# EAGLE design Grove - RGB LED Ring (20-WS2813 Mini) (EAGLE 6.4)
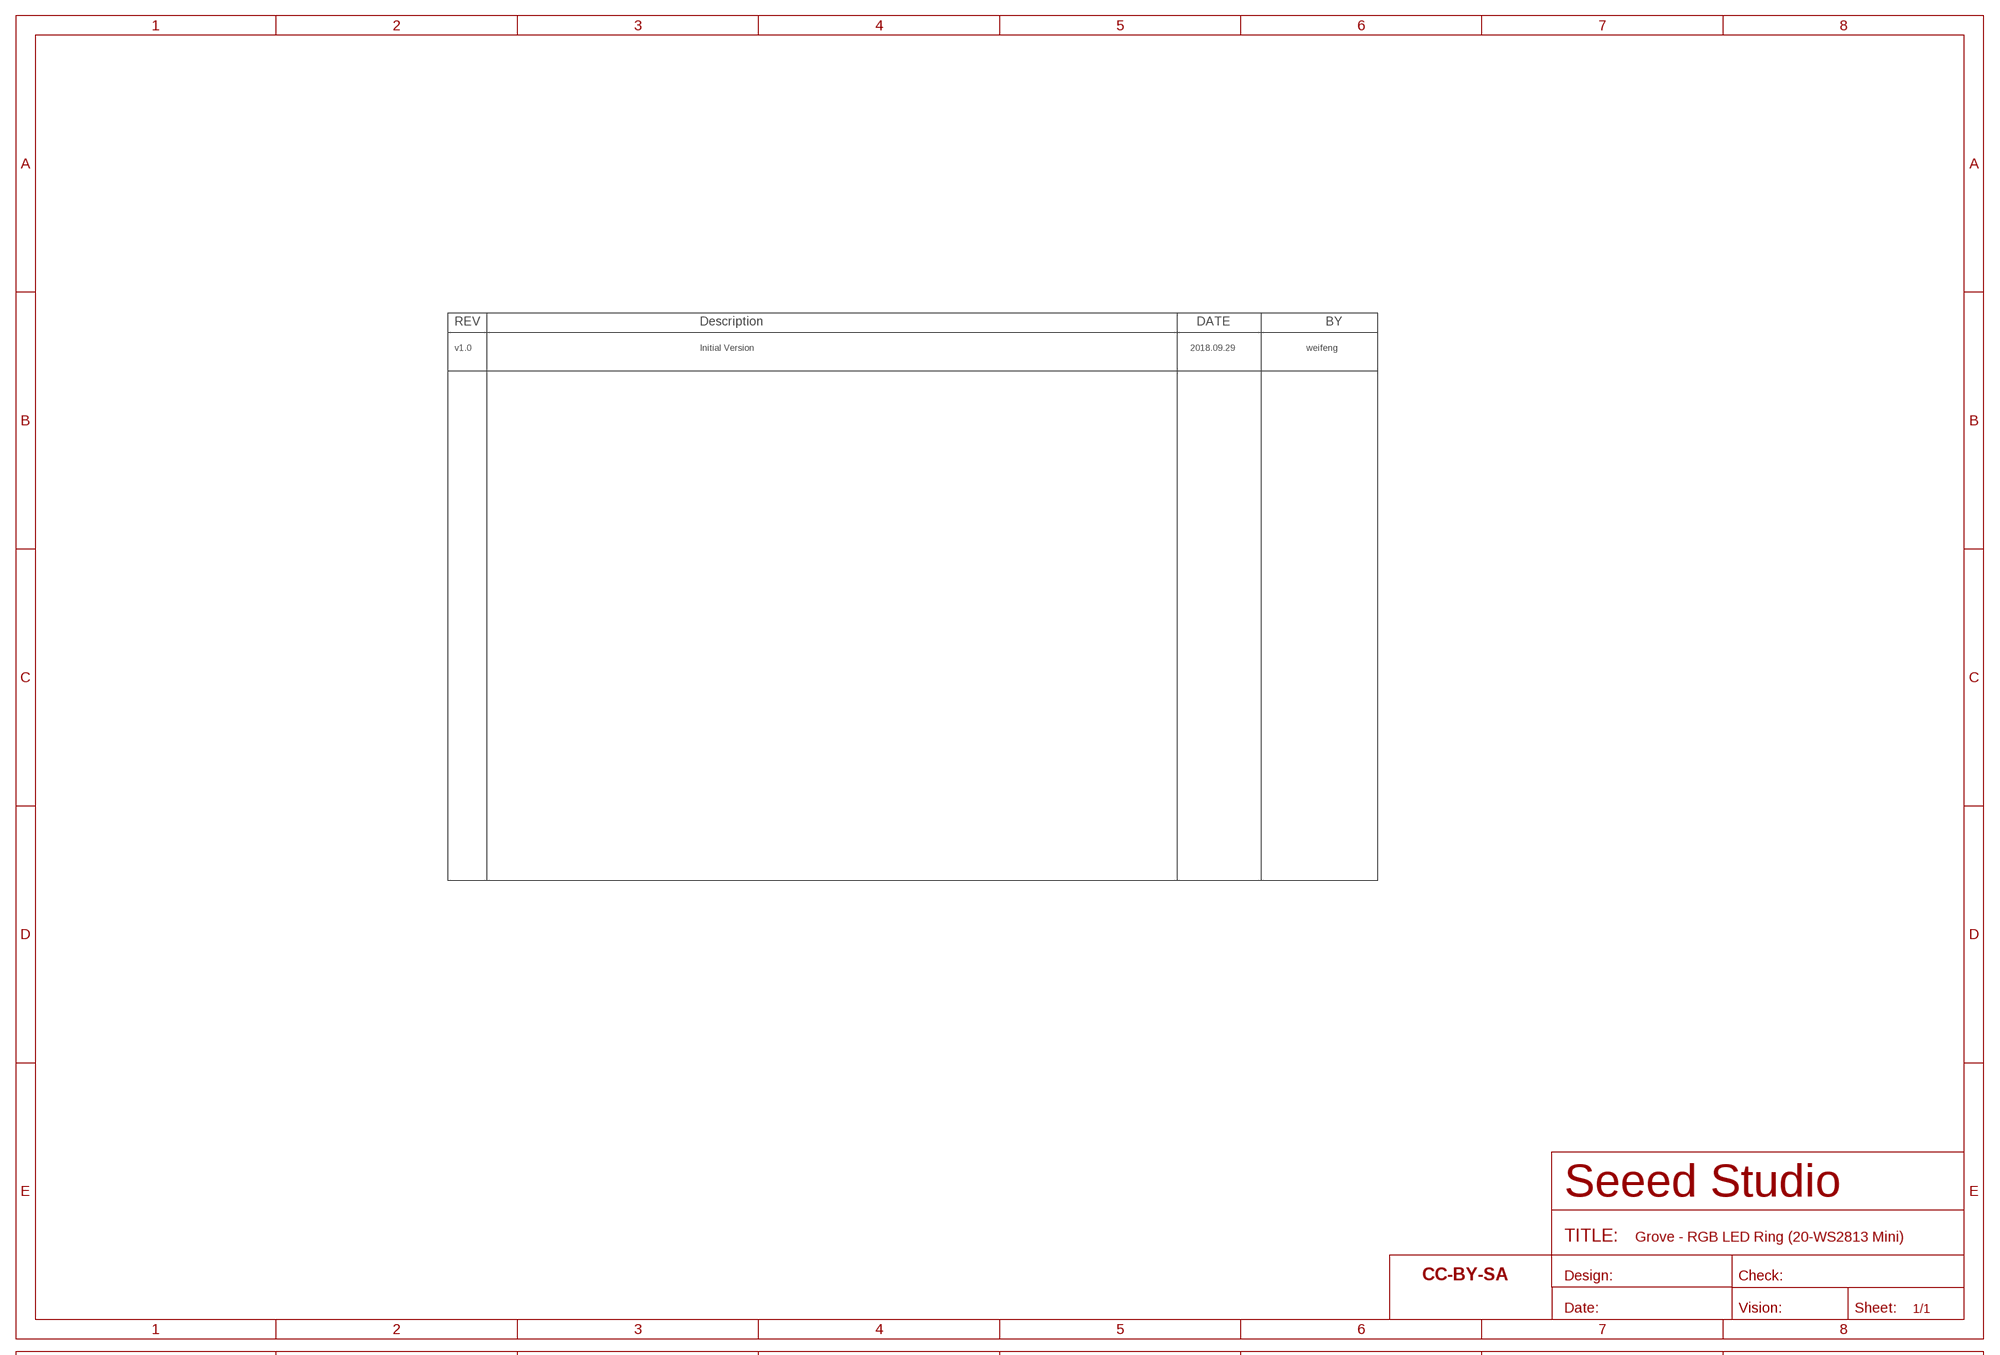
[diagram p0: schematic, sheet 1, part 1 of 2]
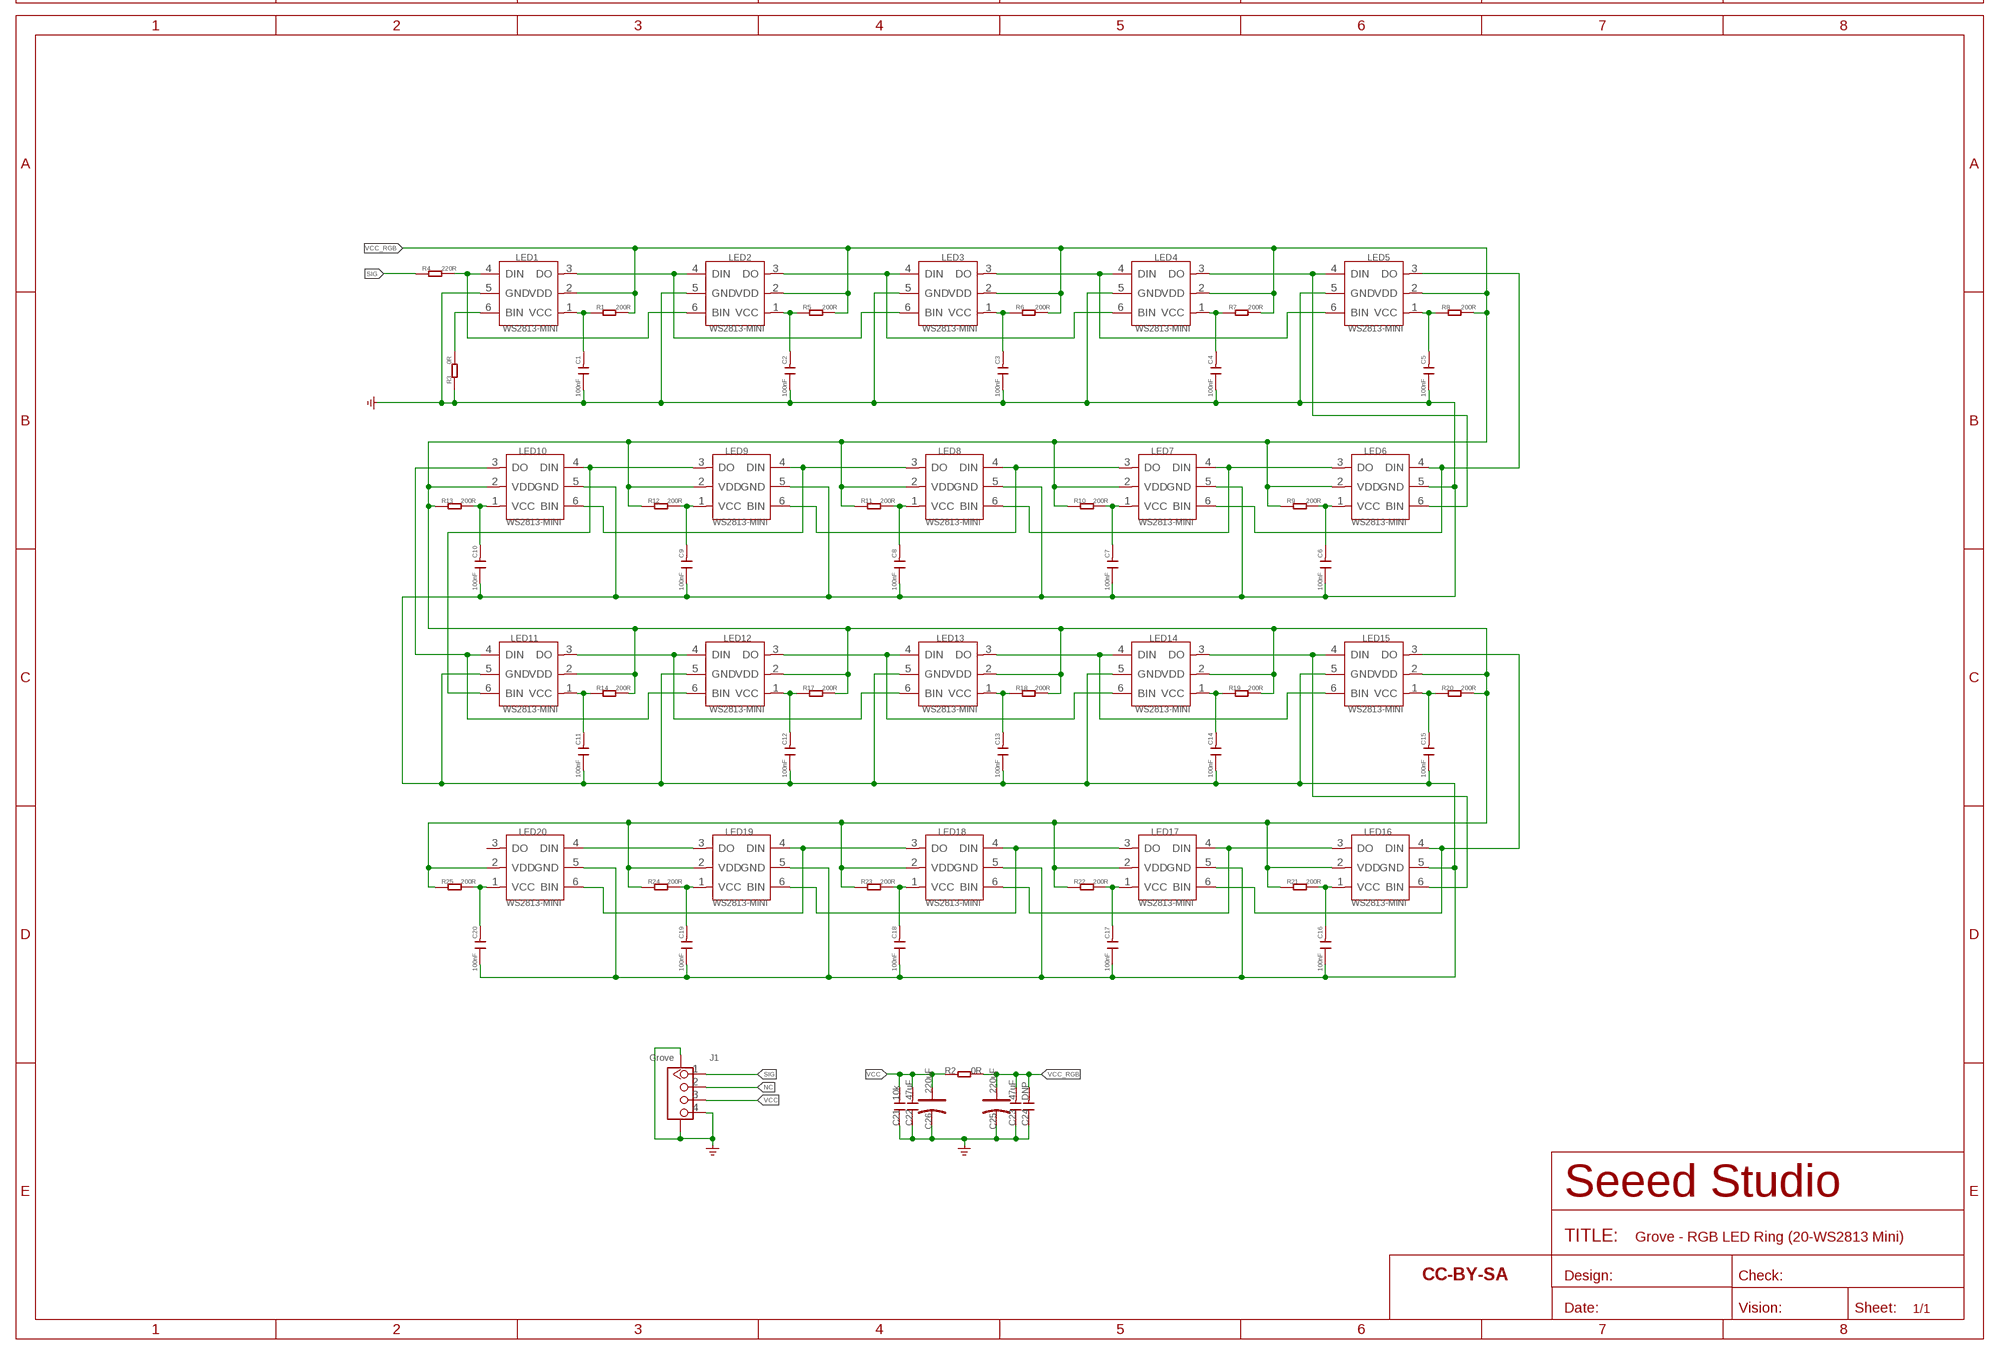
[diagram p1: schematic, sheet 1, part 2 of 2]

## Parts
C1  100nF  C-0603  [C0603]
C2  100nF  C-0603  [C0603]
C3  100nF  C-0603  [C0603]
C4  100nF  C-0603  [C0603]
C5  100nF  C-0603  [C0603]
C6  100nF  C-0603  [C0603]
C7  100nF  C-0603  [C0603]
C8  100nF  C-0603  [C0603]
C9  100nF  C-0603  [C0603]
C10  100nF  C-0603  [C0603]
C11  100nF  C-0603  [C0603]
C12  100nF  C-0603  [C0603]
C13  100nF  C-0603  [C0603]
C14  100nF  C-0603  [C0603]
C15  100nF  C-0603  [C0603]
C16  100nF  C-0603  [C0603]
C17  100nF  C-0603  [C0603]
C18  100nF  C-0603  [C0603]
C19  100nF  C-0603  [C0603]
C20  100nF  C-0603  [C0603]
C21  10k  CAP-0603  [C0603@1]
C22  47uF  CAP-0805  [C0805]
C23  47uF  CAP-0805  [C0805]
C24  DNP  CAP-0603  [C0603@1]
C25  220uF  CAP-POLAR-AVX-B  [AVX-B]
C26  220uF  CAP-POLAR-AVX-B  [AVX-B]
FR1  SEEEDSTUDIO-OPEN-SCH-FRAME-BIG  [SEEEDSTUDIO-PCB-FRAME]
FR2  SEEEDSTUDIO-OPEN-SCH-FRAME-BIG  [SEEEDSTUDIO-PCB-FRAME]
J1  Grove  GROVE-CONNECTOR-SMD'DD'  [HW4-SMD-2.0]
LED1  WS2813-MINI  LED-RGB-6P-WS2813  [LED6-1.1-3.5X3.5X0.95MM]
LED2  WS2813-MINI  LED-RGB-6P-WS2813  [LED6-1.1-3.5X3.5X0.95MM]
LED3  WS2813-MINI  LED-RGB-6P-WS2813  [LED6-1.1-3.5X3.5X0.95MM]
LED4  WS2813-MINI  LED-RGB-6P-WS2813  [LED6-1.1-3.5X3.5X0.95MM]
LED5  WS2813-MINI  LED-RGB-6P-WS2813  [LED6-1.1-3.5X3.5X0.95MM]
LED6  WS2813-MINI  LED-RGB-6P-WS2813  [LED6-1.1-3.5X3.5X0.95MM]
LED7  WS2813-MINI  LED-RGB-6P-WS2813  [LED6-1.1-3.5X3.5X0.95MM]
LED8  WS2813-MINI  LED-RGB-6P-WS2813  [LED6-1.1-3.5X3.5X0.95MM]
LED9  WS2813-MINI  LED-RGB-6P-WS2813  [LED6-1.1-3.5X3.5X0.95MM]
LED10  WS2813-MINI  LED-RGB-6P-WS2813  [LED6-1.1-3.5X3.5X0.95MM]
LED11  WS2813-MINI  LED-RGB-6P-WS2813  [LED6-1.1-3.5X3.5X0.95MM]
LED12  WS2813-MINI  LED-RGB-6P-WS2813  [LED6-1.1-3.5X3.5X0.95MM]
LED13  WS2813-MINI  LED-RGB-6P-WS2813  [LED6-1.1-3.5X3.5X0.95MM]
LED14  WS2813-MINI  LED-RGB-6P-WS2813  [LED6-1.1-3.5X3.5X0.95MM]
LED15  WS2813-MINI  LED-RGB-6P-WS2813  [LED6-1.1-3.5X3.5X0.95MM]
LED16  WS2813-MINI  LED-RGB-6P-WS2813  [LED6-1.1-3.5X3.5X0.95MM]
LED17  WS2813-MINI  LED-RGB-6P-WS2813  [LED6-1.1-3.5X3.5X0.95MM]
LED18  WS2813-MINI  LED-RGB-6P-WS2813  [LED6-1.1-3.5X3.5X0.95MM]
LED19  WS2813-MINI  LED-RGB-6P-WS2813  [LED6-1.1-3.5X3.5X0.95MM]
LED20  WS2813-MINI  LED-RGB-6P-WS2813  [LED6-1.1-3.5X3.5X0.95MM]
R1  200R  R-0603  [R0603]
R2  0R  RES-0805  [R0805]
R3  0R  R-0603  [R0603]
R4  220R  R-0603  [R0603]
R5  200R  R-0603  [R0603]
R6  200R  R-0603  [R0603]
R7  200R  R-0603  [R0603]
R8  200R  R-0603  [R0603]
R9  200R  R-0603  [R0603]
R10  200R  R-0603  [R0603]
R11  200R  R-0603  [R0603]
R12  200R  R-0603  [R0603]
R13  200R  R-0603  [R0603]
R14  200R  R-0603  [R0603]
R17  200R  R-0603  [R0603]
R18  200R  R-0603  [R0603]
R19  200R  R-0603  [R0603]
R20  200R  R-0603  [R0603]
R21  200R  R-0603  [R0603]
R22  200R  R-0603  [R0603]
R23  200R  R-0603  [R0603]
R24  200R  R-0603  [R0603]
R25  200R  R-0603  [R0603]

## Nets
GND: C1.1 C2.1 C3.1 C4.1 C5.1 C6.1 C7.1 C8.1 C9.1 C10.1 C11.1 C12.1 C13.1 C14.1 C15.1 C16.1 C17.1 C18.1 C19.1 C20.1 C21.1 C22.1 C23.1 C24.1 C25.- C26.- J1.4 J1.SS1 J1.SS2 LED1.5(GND) LED2.5(GND) LED3.5(GND) LED4.5(GND) LED5.5(GND) LED6.5(GND) LED7.5(GND) LED8.5(GND) LED9.5(GND) LED10.5(GND) LED11.5(GND) LED12.5(GND) LED13.5(GND) LED14.5(GND) LED15.5(GND) LED16.5(GND) LED17.5(GND) LED18.5(GND) LED19.5(GND) LED20.5(GND) R3.1 ; supply symbol labelled GND_POWER
N$1: C1.2 LED1.1(VCC) R1.1
N$2: LED2.3(DO) LED3.4(DIN) LED4.6(BIN)
N$3: C4.2 LED4.1(VCC) R7.1
N$4: LED1.6(BIN) R3.2
N$5: LED3.3(DO) LED4.4(DIN) LED5.6(BIN)
N$6: LED1.4(DIN) LED2.6(BIN) R4.2
N$7: LED4.3(DO) LED5.4(DIN) LED6.6(BIN)
N$8: C5.2 LED5.1(VCC) R8.1
N$9: LED5.3(DO) LED6.4(DIN) LED7.6(BIN)
N$10: C2.2 LED2.1(VCC) R5.1
N$12: C6.2 LED6.1(VCC) R9.2
N$14: LED1.3(DO) LED2.4(DIN) LED3.6(BIN)
N$16: C3.2 LED3.1(VCC) R6.1
N$18: LED6.3(DO) LED7.4(DIN) LED8.6(BIN)
N$21: C7.2 LED7.1(VCC) R10.2
N$23: LED7.3(DO) LED8.4(DIN) LED9.6(BIN)
N$26: C8.2 LED8.1(VCC) R11.2
N$29: LED8.3(DO) LED9.4(DIN) LED10.6(BIN)
N$32: C9.2 LED9.1(VCC) R12.2
N$35: LED9.3(DO) LED10.4(DIN) LED11.6(BIN)
N$38: C10.2 LED10.1(VCC) R13.2
N$41: C11.2 LED11.1(VCC) R14.1
N$43: LED10.3(DO) LED11.4(DIN) LED12.6(BIN)
N$44: C12.2 LED12.1(VCC) R17.1
N$45: LED11.3(DO) LED12.4(DIN) LED13.6(BIN)
N$46: C13.2 LED13.1(VCC) R18.1
N$47: LED12.3(DO) LED13.4(DIN) LED14.6(BIN)
N$48: C14.2 LED14.1(VCC) R19.1
N$49: LED13.3(DO) LED14.4(DIN) LED15.6(BIN)
N$50: LED14.3(DO) LED15.4(DIN) LED16.6(BIN)
N$51: C15.2 LED15.1(VCC) R20.1
N$52: LED15.3(DO) LED16.4(DIN) LED17.6(BIN)
N$53: C16.2 LED16.1(VCC) R21.2
N$54: LED16.3(DO) LED17.4(DIN) LED18.6(BIN)
N$55: C17.2 LED17.1(VCC) R22.2
N$56: LED17.3(DO) LED18.4(DIN) LED19.6(BIN)
N$57: C18.2 LED18.1(VCC) R23.2
N$58: LED18.3(DO) LED19.4(DIN) LED20.6(BIN)
N$59: C19.2 LED19.1(VCC) R24.2
N$60: LED19.3(DO) LED20.4(DIN)
N$61: C20.2 LED20.1(VCC) R25.2
NC: J1.2
SIG: J1.1 R4.1
VCC: C21.2 C22.2 C26.+ J1.3 R2.1
VCC_RGB: C23.2 C24.2 C25.+ LED1.2(VDD) LED2.2(VDD) LED3.2(VDD) LED4.2(VDD) LED5.2(VDD) LED6.2(VDD) LED7.2(VDD) LED8.2(VDD) LED9.2(VDD) LED10.2(VDD) LED11.2(VDD) LED12.2(VDD) LED13.2(VDD) LED14.2(VDD) LED15.2(VDD) LED16.2(VDD) LED17.2(VDD) LED18.2(VDD) LED19.2(VDD) LED20.2(VDD) R1.2 R2.2 R5.2 R6.2 R7.2 R8.2 R9.1 R10.1 R11.1 R12.1 R13.1 R14.2 R17.2 R18.2 R19.2 R20.2 R21.1 R22.1 R23.1 R24.1 R25.1
Unconnected: LED20.3(DO)

## Notes on the sheet
- v1.0 | Initial Version | 2018.09.29 | weifeng

## Library data of the parts
C1-C20 = Discrete-small:C*: Ceramic Capacitors
C21-C24 = Discrete-new:CAP: Ceramic Capacitors
C25 C26 = Discrete-new:CAP-POLAR: Electrolytic Capacitors,Tantalum Capacitors and Super Capacitors
FR1 FR2 = moudle-new:SEEEDSTUDIO-OPEN-SCH-FRAME-BIG
J1 = Connector-new:GROVE-CONNECTOR-SMD: 4P-SMD-2.0:320110030;4P-SMD-2.0-90D:320110032
LED1-LED20 = Discrete-new:LED-RGB-6P
R1 R3-R14 R17-R25 = Discrete-small:R*
R2 = Discrete-new:RES

## Net classes
3 usbvcc: width 0.203 mm, drill 0.305 mm, clearance 0.203 mm

## Board
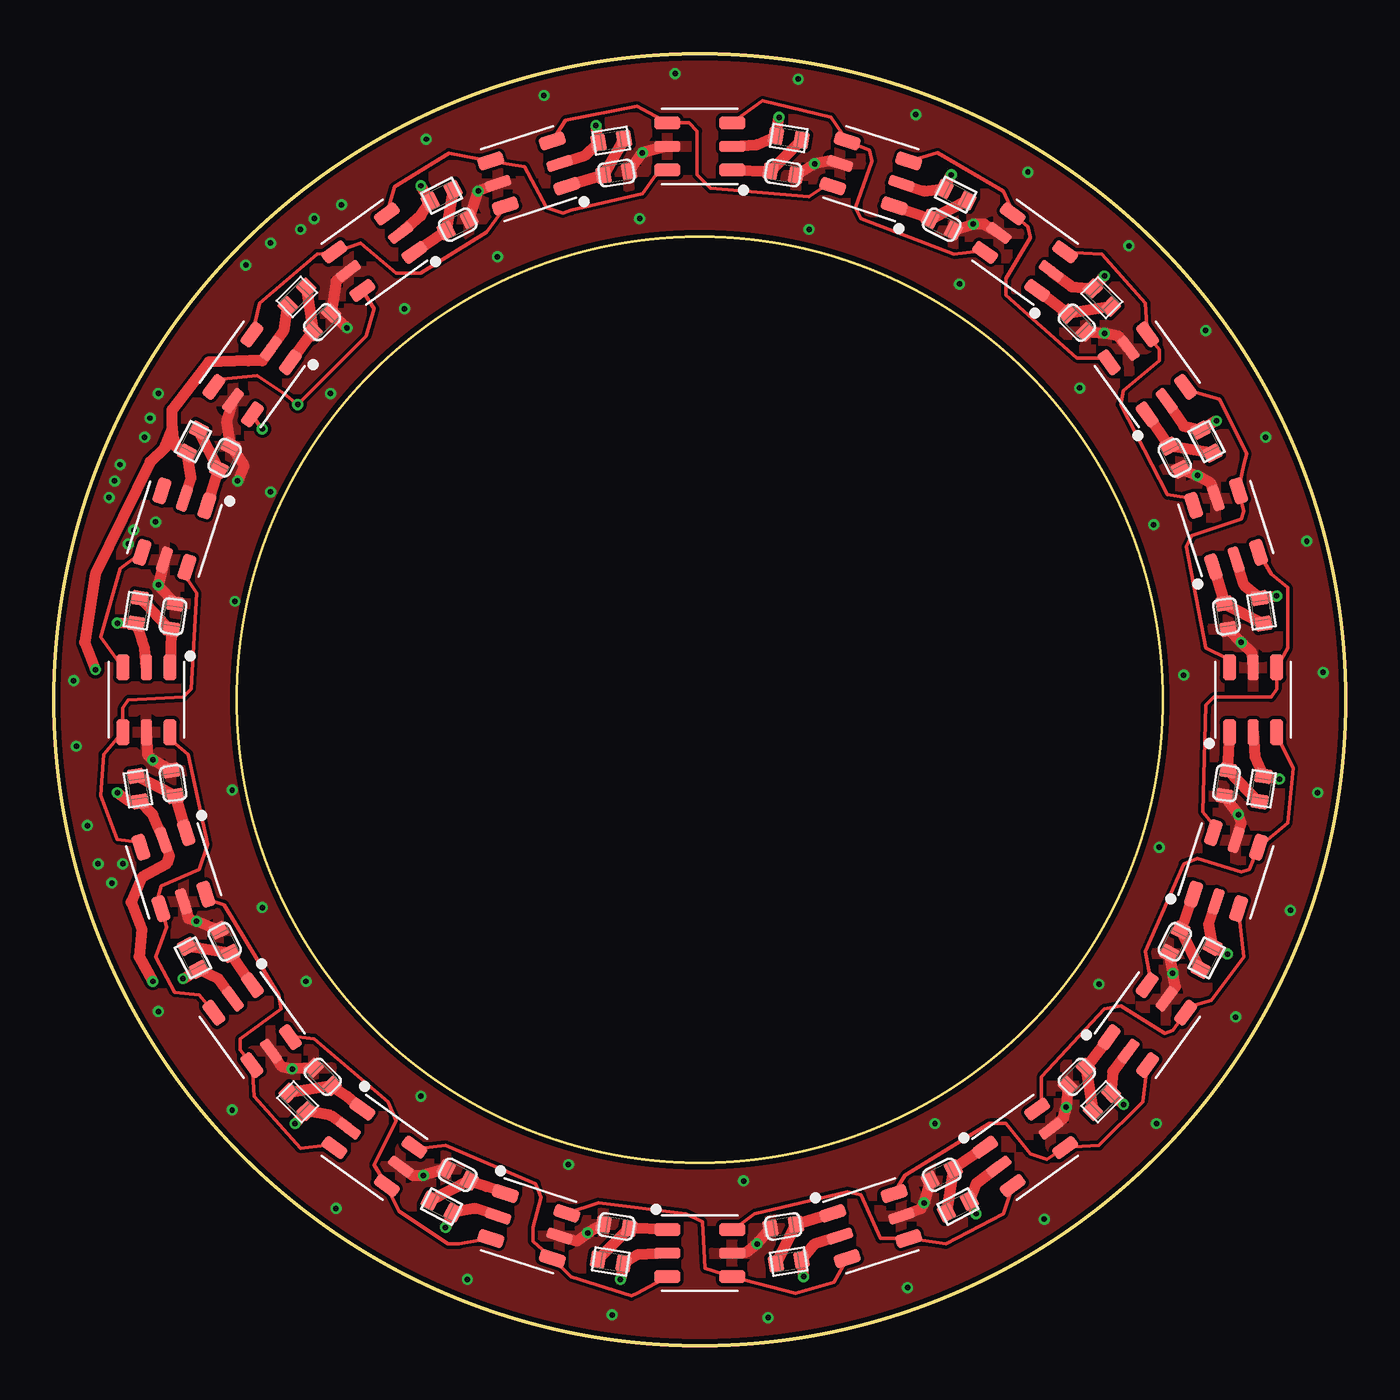
[diagram p2: board, top side]
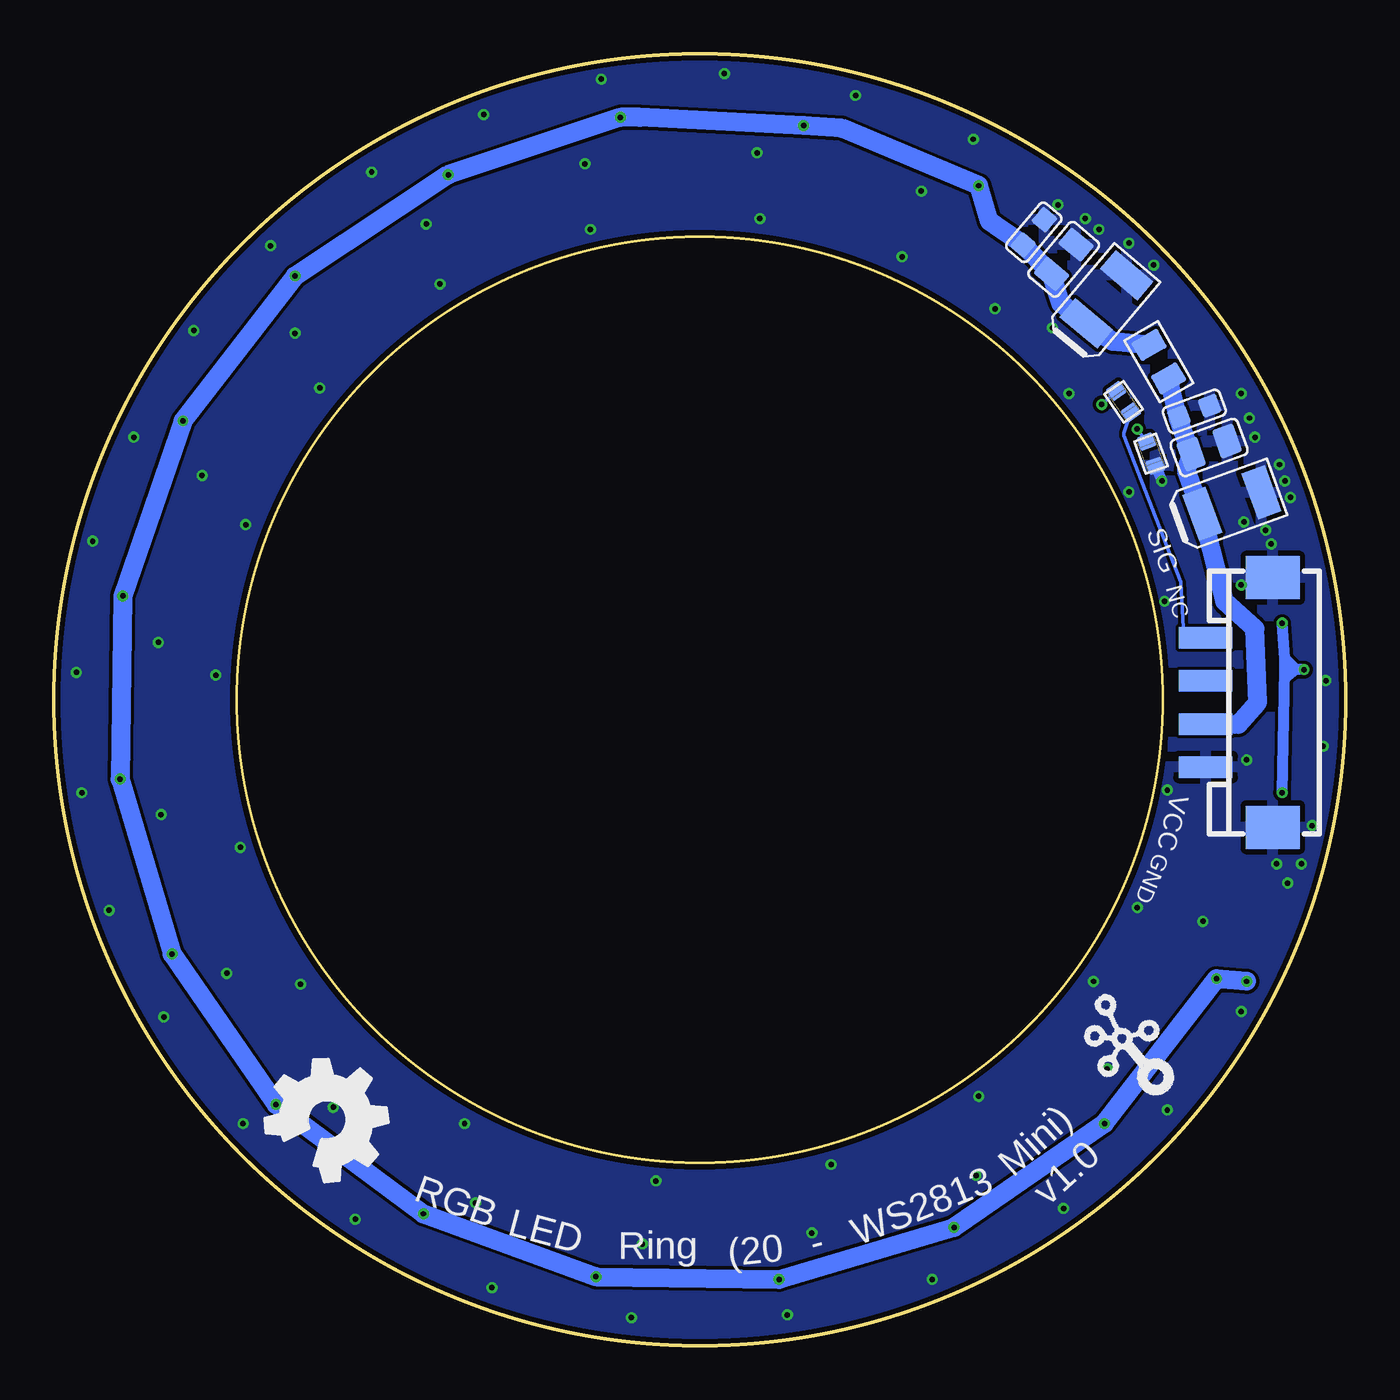
[diagram p3: board, bottom side, seen from below]

Size 60 x 60 mm. Coordinates in mm from the lower left corner, seen from the top.
Outline: circle at 30,30 radius 21.5
Outline: circle at 30,30 radius 30
Copper layers (1*16): Top 0.035mm / dielectric 1.5mm / Bottom 0.035mm
Design rules "SeeedStudio_2layer_DRU_no_angle_20140221": minimum track width 1mil, minimum drill 10mil, track to track 6mil, track to pad 6mil, pad to pad 6mil, via to via 6mil, smd to smd 0mil, copper to edge 10mil, drill to drill 10mil, minimum pad ring 4mil, minimum via ring 4mil, stop-mask expansion 2mil, vias tented up to drill 25mil, thermal gap 10mil

### Footprints (pad centres in the part's own frame; a part is rotated, then mirrored left to right if it is on the bottom)
C0603 = smd 0.762 x 0.696: 1 0,0.602; 2 0,-0.602
C0603' = smd 0.889 x 0.889: 1 -0.762,0; 2 0.762,0
C0805 = smd 1.016 x 1.397: 1 -0.889,0; 2 0.889,0
AVX-B = smd 1.143 x 2.286: + 1.46,0; - -1.46,0
HW4-SMD-2.0 = smd 1 x 2.5: 1 -3,0; 2 -1,0; 3 1,0; 4 3,0 | smd 2 x 2.5: SS1 -5.8,3.123; SS2 5.8,3.123
LED6-1.1-3.5X3.5X0.95MM = smd 1.2 x 0.6: 1 -1.5,1.1; 3 -1.5,-1.1; 4 1.5,-1.1; 6 1.5,1.1 | smd 1.2 x 0.5: 2 -1.5,0; 5 1.5,0
R0603 = smd 0.762 x 0.696: 1 0,0.602; 2 0,-0.602
R0805 = smd 1.397 x 1.016: 1 0,0.889; 2 0,-0.889

### Placement (x,y rotation side)
C1  12.46,47.54 315 top
C2  18.76,52.07 297 top
C3  26.13,54.46 279 top
C4  33.87,54.46 261 top
C5  41.24,52.07 243 top
C6  47.51,47.51 225 top
C7  52.07,41.24 207 top
C8  54.46,33.87 189 top
C9  54.46,26.13 171 top
C10  52.07,18.76 153 top
C11  47.51,12.49 135 top
C12  41.24,7.93 117 top
C13  33.87,5.54 99 top
C14  26.13,5.54 81 top
C15  18.76,7.93 63 top
C16  12.49,12.49 45 top
C17  7.93,18.76 27 top
C18  5.54,26.13 9 top
C19  5.54,33.87 351 top
C20  7.93,41.24 333 top
C21  10k  [C0603']  7.03,43.39 200 bottom
C22  6.34,41.71 200 bottom
C23  13.09,50.45 230 bottom
C24  DNP  [C0603']  14.49,51.71 230 bottom
C25  11.11,48.6 230 bottom
C26  5.28,39.13 200 bottom
FR1  -4.04,-40.74 0 top  (outside the outline)
FR2  -3.53,-34.14 0 top  (outside the outline)
J1  6.5,29.87 270 bottom
LED1  9.21,45.11 234 top
LED2  14.89,50.79 216 top
LED3  22.06,54.44 198 top
LED4  30,55.7 180 top
LED5  37.94,54.44 162 top
LED6  45.11,50.79 144 top
LED7  50.79,45.11 126 top
LED8  54.44,37.94 108 top
LED9  55.7,30 90 top
LED10  54.44,22.06 72 top
LED11  50.79,14.89 54 top
LED12  45.11,9.21 36 top
LED13  37.94,5.56 18 top
LED14  30,4.3 0 top
LED15  22.06,5.56 342 top
LED16  14.89,9.21 324 top
LED17  9.21,14.89 306 top
LED18  5.56,22.06 288 top
LED19  4.3,30 270 top
LED20  5.6,37.93 252 top
R1  11.28,48.72 315 top
R2  8.68,45.7 210 bottom
R3  9.05,41.43 200 bottom
R4  10.32,43.84 215 bottom
R5  18.01,53.41 297 top
R6  25.89,55.97 279 top
R7  34.13,56.09 261 top
R8  41.88,53.45 243 top
R9  48.68,48.68 45 top
R10  53.54,41.99 27 top
R11  56.09,34.13 9 top
R12  56.09,25.87 351 top
R13  53.54,18.01 333 top
R14  48.68,11.32 135 top
R17  41.99,6.46 117 top
R18  34.13,3.91 99 top
R19  25.87,3.91 81 top
R20  18.01,6.46 63 top
R21  11.32,11.32 225 top
R22  6.46,18.01 207 top
R23  3.91,25.87 189 top
R24  3.91,34.13 171 top
R25  6.46,41.99 153 top
U$7  [GROVE-SILK-SMALL]  9.91,10.29 40 bottom
U$8  [OSHW_FILLX200_NOTEXT]  50.95,10.57 320 bottom

### Tracks (layer width: path | path; a pad name or v marks a point on that pad's centre or on a via)
GND  (via drill 0.25 pad 0.51)
  Top 0.5: LED3.5 v19.71,53.62 C2.1 | C3.1 v27.33,55.4 LED4.5 | C4.1 v35.33,54.89 35.97,55.02 LED5.5 | C5.1 v42.7,52.1 43.21,52.1 LED6.5
  Top 0.508: C6.1 v48.8,47.02 49.43,46.89 LED7.5 | C7.1 v53.11,40.41 53.75,40.03 LED8.5 | C8.1 v55.15,32.67 55.65,32.16 LED9.5 | C9.1 v55.02,24.67 55.15,24.29 LED10.5 | C10.1 v51.97,17.3 52.1,16.66 LED11.5 | C11.1 v47.02,11.08 46.89,10.57 LED12.5 | C12.1 v40.41,6.63 40.29,6.38 LED13.5 | C13.1 v32.67,4.73 32.16,4.35 LED14.5 | C14.1 24.89,5.29 | 24.89,5.29 v24.79,5.23 | LED15.5 24.29,4.85 24.89,5.29 | LED16.5 16.66,7.9 v17.17,7.9 C15.1 | C16.1 v11.08,12.86 10.57,12.98 LED17.5 | LED18.5 6.25,19.84 v6.63,19.71 C17.1 | C18.1 v4.6,27.21 4.35,27.46 4.35,27.71 LED19.5 | v13.62,47.27 C1.1 13.11,49.43 LED2.5 | LED1.5 8.03,42.95 C20.1 R3.1 v8.54,40.16 | C19.1 v4.85,35.33 LED20.5
  Bottom 0.508: R3.1 v8.54,40.16
  other vias: 8.92,50.19 10.06,51.21 11.46,51.84 12.09,52.35 13.36,52.99 4.85,44.22 4.47,43.08 4.22,42.19 3.08,40.92 2.82,40.16 2.57,39.4 17.3,56.03 22.76,58.07 28.86,59.08 34.57,58.83 40.03,57.18 45.24,54.51 49.94,51.08 53.5,47.14 56.29,42.19 58.19,37.37 58.96,31.27 58.7,25.68 57.43,20.22 54.89,15.27 51.21,10.32 46,5.87 39.65,2.7 33.17,1.3 25.94,1.43 19.2,3.08 13.11,6.38 8.28,10.95 4.85,15.52 2.7,21.49 9.68,20.35 11.71,16.92 17.05,11.59 23.9,8.41 32.03,7.65 40.92,10.32 48.54,16.79 51.34,23.14 52.48,31.14 51.08,38.13 47.65,44.48 42.06,49.3 35.08,51.84 27.21,52.35 20.6,50.57 16.28,48.16 12.86,44.22 10.06,39.65 8.41,34.57 8.28,25.81 3.71,37.87 3.46,37.24 4.73,38.26 2.06,22.38 3.2,22.38 1.55,24.16 1.04,27.84 0.92,30.89
  pour Bottom: 10.82,61.11 42.57,61.11 60.48,43.21 60.48,17.05 42.95,-0.48 16.66,-0.48 -3.15,19.33 -3.15,47.14
  pour Top: 16.28,62.38 48.92,62.38 63.27,48.03 63.27,14.51 47.91,-0.86 15.9,-0.86 -2.89,17.94 -2.89,43.21
N$1
  Top 0.508: LED1.1 C1.2 R1.1
N$2
  Top 0.152: LED2.3 15.82,53.83 18.35,55.39 LED3.4
  Top 0.153: LED3.4 21.87,54.77 22.89,52.86 23.65,52.61 24.03,52.73 27.33,53.5 27.97,54.38 LED4.6
N$3
  Top 0.5: R7.1 C4.2 LED4.1
N$4  (via drill 0.25 pad 0.51)
  Top 0.152: v9.68,42.57 9.55,42.7 LED1.6
  Bottom 0.152: R3.2 v9.68,42.57
N$5
  Top 0.153: LED3.3 23.78,56.92 27.08,57.56 27.33,57.43 LED4.4 29.49,56.8 29.87,56.42 29.87,54.38 30.51,53.75 35.08,53.37 35.84,53.88 36.22,53.88 LED5.6
N$6  (via drill 0.25 pad 0.51)
  Top 0.152: LED1.4 7.81,44.9 9.45,45.05 10.7,44.22 v11.33,43.72 14.51,46.89 14.89,48.16 LED2.6
  Bottom 0.152: R4.2 v11.33,43.72
N$7
  Top 0.153: LED4.3 32.92,57.81 36.1,57.05 LED5.4 37.87,55.53 38,55.02 37.24,52.86 37.49,52.35 41.81,50.7 42.95,50.83 LED6.6
N$8
  Top 0.5: R8.1 40.8,52.35 C5.2 LED5.1
N$9
  Top 0.153: LED5.3 41.05,55.4 44.1,53.62 44.61,52.48 | LED6.4 45.24,51.97 45.37,51.46 44.22,49.56 44.22,48.8 47.53,45.88 48.67,45.88 LED7.6
  Top 0.508: 44.61,52.48 LED6.4
N$10
  Top 0.5: LED2.1 C2.2 R5.1
N$12
  Top 0.508: LED6.1 C6.2 R9.2
N$14
  Top 0.152: LED1.3 9.55,48.41 12.22,50.7 LED2.4
  Top 0.153: LED3.6 20.09,51.72 17.05,49.81 15.9,49.81 14.25,51.21 LED2.4
N$16
  Top 0.5: R6.1 C3.2 LED3.1
N$18
  Top 0.152: LED6.3 48.67,50.7 50.7,48.41 LED7.4 51.34,46.26 51.34,45.75 49.69,44.35 49.56,43.72 51.72,39.52 52.61,39.4 LED8.6
N$21
  Top 0.508: LED7.1 C7.2 R10.2
N$23
  Top 0.152: LED7.3 52.73,44.35 54.13,43.97 55.4,41.43 55.27,40.92 LED8.4 55.27,38.76 55.15,38.38 52.86,37.62 52.61,37.11 53.5,32.41 54.51,31.91 54.64,31.27
  Top 0.508: 54.64,31.27 LED9.6
N$26
  Top 0.508: LED8.1 54.38,34.45 54.39,34.46 | C8.2 54.39,34.46 | 54.39,34.46 R11.2
N$29
  Top 0.152: LED8.3 56.54,35.84 57.3,35.21 57.3,32.41 LED9.4 56.8,30.51 56.54,30.13 53.88,30.13 53.5,29.75 53.37,24.79 53.88,24.16 LED10.6
N$32
  Top 0.508: LED9.1 54.51,26.7 C9.2 55.97,25.24 | 55.97,25.24 56.03,25.17 | R12.2 55.97,25.24
N$35
  Top 0.152: LED9.3 56.8,28.35 57.56,26.82 57.3,24.29 LED10.4 55.53,22.13 55.15,22 53.11,22.63 52.48,22.38 50.7,18.32 50.95,16.92 LED11.6
N$38
  Top 0.508: LED10.1 C10.2 53.24,17.43 R13.2
N$41
  Top 0.508: LED11.1 C11.2 R14.1
N$43
  Top 0.152: LED10.3 55.27,18.06 53.75,16.03 52.86,15.78 LED11.4 51.97,14.63 51.59,14.51 49.56,15.78 48.8,15.65 45.88,12.47 45.88,11.2 45.62,10.95
  Top 0.508: LED12.6 45.62,10.95
N$44
  Top 0.508: LED12.1 C12.2 R17.1
N$45
  Top 0.152: LED11.3 50.57,11.33 48.54,9.3 LED12.4 46.13,8.66 45.37,8.92 44.22,10.32 43.46,10.32 39.52,7.9 LED13.6
N$46
  Top 0.508: LED13.1 34.45,5.62 34.46,5.61 | C13.2 34.46,5.61 | 34.46,5.61 R18.1
N$47
  Top 0.152: LED12.3 44.1,6.12 41.43,4.73 LED13.4 38.38,4.98 37.49,7.01 36.86,7.14 32.54,6.12 31.52,5.36 LED14.6
N$48
  Top 0.508: LED14.1 C14.2 R19.1
N$49
  Top 0.152: LED13.3 36.22,2.95 34.45,2.44 LED14.4 30.25,3.58 30.13,5.74 29.36,6.12 25.3,6.63 LED15.6
N$50
  Top 0.152: LED14.3 27.08,2.44 26.82,2.31 24.03,3.2 LED15.4 22.25,4.85 22.25,5.49 22.63,6.89 22.38,7.52 18.19,9.3 17.05,9.17 LED16.6
N$51
  Top 0.508: LED15.1 20.09,7.39 C15.2 R20.1
N$52
  Top 0.152: LED15.3 18.82,4.73 18.32,4.73 16.03,6.25 15.52,7.27 LED16.4 14.89,8.41 15.9,10.44 15.52,11.33 12.09,14.25 10.95,14.38 10.82,14.38 LED17.6
N$53
  Top 0.508: LED16.1 13.62,11.59 C16.2 R21.2
N$54
  Top 0.152: LED16.3 12.6,9.3 11.46,9.17 9.3,11.59 LED17.4 8.66,13.74 8.66,14.25 10.57,15.65 10.44,16.28 7.9,20.48 7.14,20.73 LED18.6
N$55
  Top 0.508: LED17.1 C17.2 R22.2
N$56
  Top 0.152: LED17.3 6.76,16.28 5.62,16.41 4.73,18.06 5.23,19.46 LED18.4 4.85,20.86 4.98,21.36 6.76,22.13 7.14,23.27 6.25,27.46 5.49,28.09 LED19.6
N$57
  Top 0.508: LED18.1 C18.2 R23.2
N$58
  Top 0.152: LED18.3 3.84,23.4 2.95,23.52 2.19,25.55 2.31,27.46 LED19.4 3.2,29.62 3.46,30 6,30.13 6.38,30.51 6.63,34.95 6.12,35.72 LED20.6
N$59
  Top 0.508: C19.2 5.44,33.17 | 5.44,33.17 LED19.1 | R24.2 5.44,33.17
N$60
  Top 0.152: LED19.3 2.19,32.92 3.08,36.1 LED20.4
N$61
  Top 0.508: LED20.1 C20.2 R25.2
SIG
  Bottom 0.152: R4.1 10.29,42.38 10.29,42.26 7.65,35.46 7.52,32.92 7.14,32.92 J1.1
VCC
  Bottom 0.508: 7.77,43.08 C21.2
  Bottom 0.889: J1.3 4.98,28.86 4.09,29.87 4.22,33.3 5.62,34.57 C26.+ 7.39,40.67 7.14,41.43 C22.2 7.77,43.08 R2.1
VCC_RGB  (via drill 0.25 pad 0.51)
  Top 0.5: v17.05,53.88 R5.2 17.05,52.48 LED2.2 | LED3.2 24.67,55.27 R6.2 v25.17,56.67 | LED4.2 32.67,55.78 R7.2 v33.68,57.05 | LED5.2 40.41,53.62 R8.2 v41.68,54.38
  Top 0.508: LED6.2 47.27,49.18 R9.1 v48.8,49.69 | LED7.2 52.48,42.7 R10.1 v54,42.95 | LED8.2 55.27,35.33 56.03,34.7 R11.1 v56.8,34.83 | LED9.2 55.78,27.33 R12.1 v56.92,26.32 | LED10.2 53.62,19.59 R13.1 v54.51,18.19 | LED11.2 49.18,12.73 R14.2 v49.69,11.2 | LED12.2 42.83,7.52 R17.2 v42.83,6.12 | v34.83,3.2 R18.2 34.7,3.96 35.33,4.73 LED13.2 | LED14.2 27.08,4.22 R19.2 v26.32,3.08 | LED15.2 19.59,6.38 R20.2 v18.19,5.49 | LED16.2 12.86,10.7 R21.1 v11.2,10.32 | LED17.2 7.65,17.05 R22.1 v6,17.05 | v2.95,25.68 3.46,25.3 R23.1 4.6,24.67 LED18.2 5.36,22.76 5.23,22.38 4.09,21.74 3.58,20.6 4.09,19.33 3.96,18.06 v4.6,16.92 | LED19.2 4.22,32.41 4.09,32.79 R24.1 v2.95,33.56 | LED20.2 6.38,40.29 R25.1 5.62,41.81 5.58,42.11 | 5.58,42.11 5.49,42.83 5.49,43.46 7.21,45.69 9.05,45.75 9.68,45.75 LED1.2 10.7,47.14 R1.2 | 5.58,42.11 5.11,41.67 | 5.11,41.67 4.47,41.05 1.93,35.84 1.43,32.67 v1.93,31.4 | 5.11,41.67 5.49,42.57
  Bottom 0.508: v2.95,25.68 2.83,31.39 | 2.83,31.39 2.82,31.91 | 2.82,31.91 v2.95,33.56 | v1.93,31.4 2.35,31.4 | 2.35,31.4 2.83,31.39 | 2.82,31.91 2.44,31.52 | 2.35,31.4 2.82,31.02
  Bottom 0.889: R2.2 10.82,46.64 12.09,47.53 | 12.09,47.53 C25.+ | 12.09,47.53 13.24,48.41 C23.2 C24.2 16.54,52.23 v17.05,53.88 23.4,56.54 v25.17,56.67 32.79,57.05 v33.68,57.05 v41.68,54.38 v48.8,49.69 v54,42.95 v56.8,34.83 v56.92,26.32 v54.51,18.19 v49.69,11.2 v42.83,6.12 v34.83,3.2 v26.32,3.08 v18.19,5.49 v11.2,10.32 v6,17.05 v4.6,16.92

### Text on the board
bPlace: Mini) | RGB | v1.0 | WS2813 | Ring | LED | - | (20
bNames: SIG | NC | VCC | GND